# EAGLE design Sequencer_RevD (EAGLE 7.6.0)
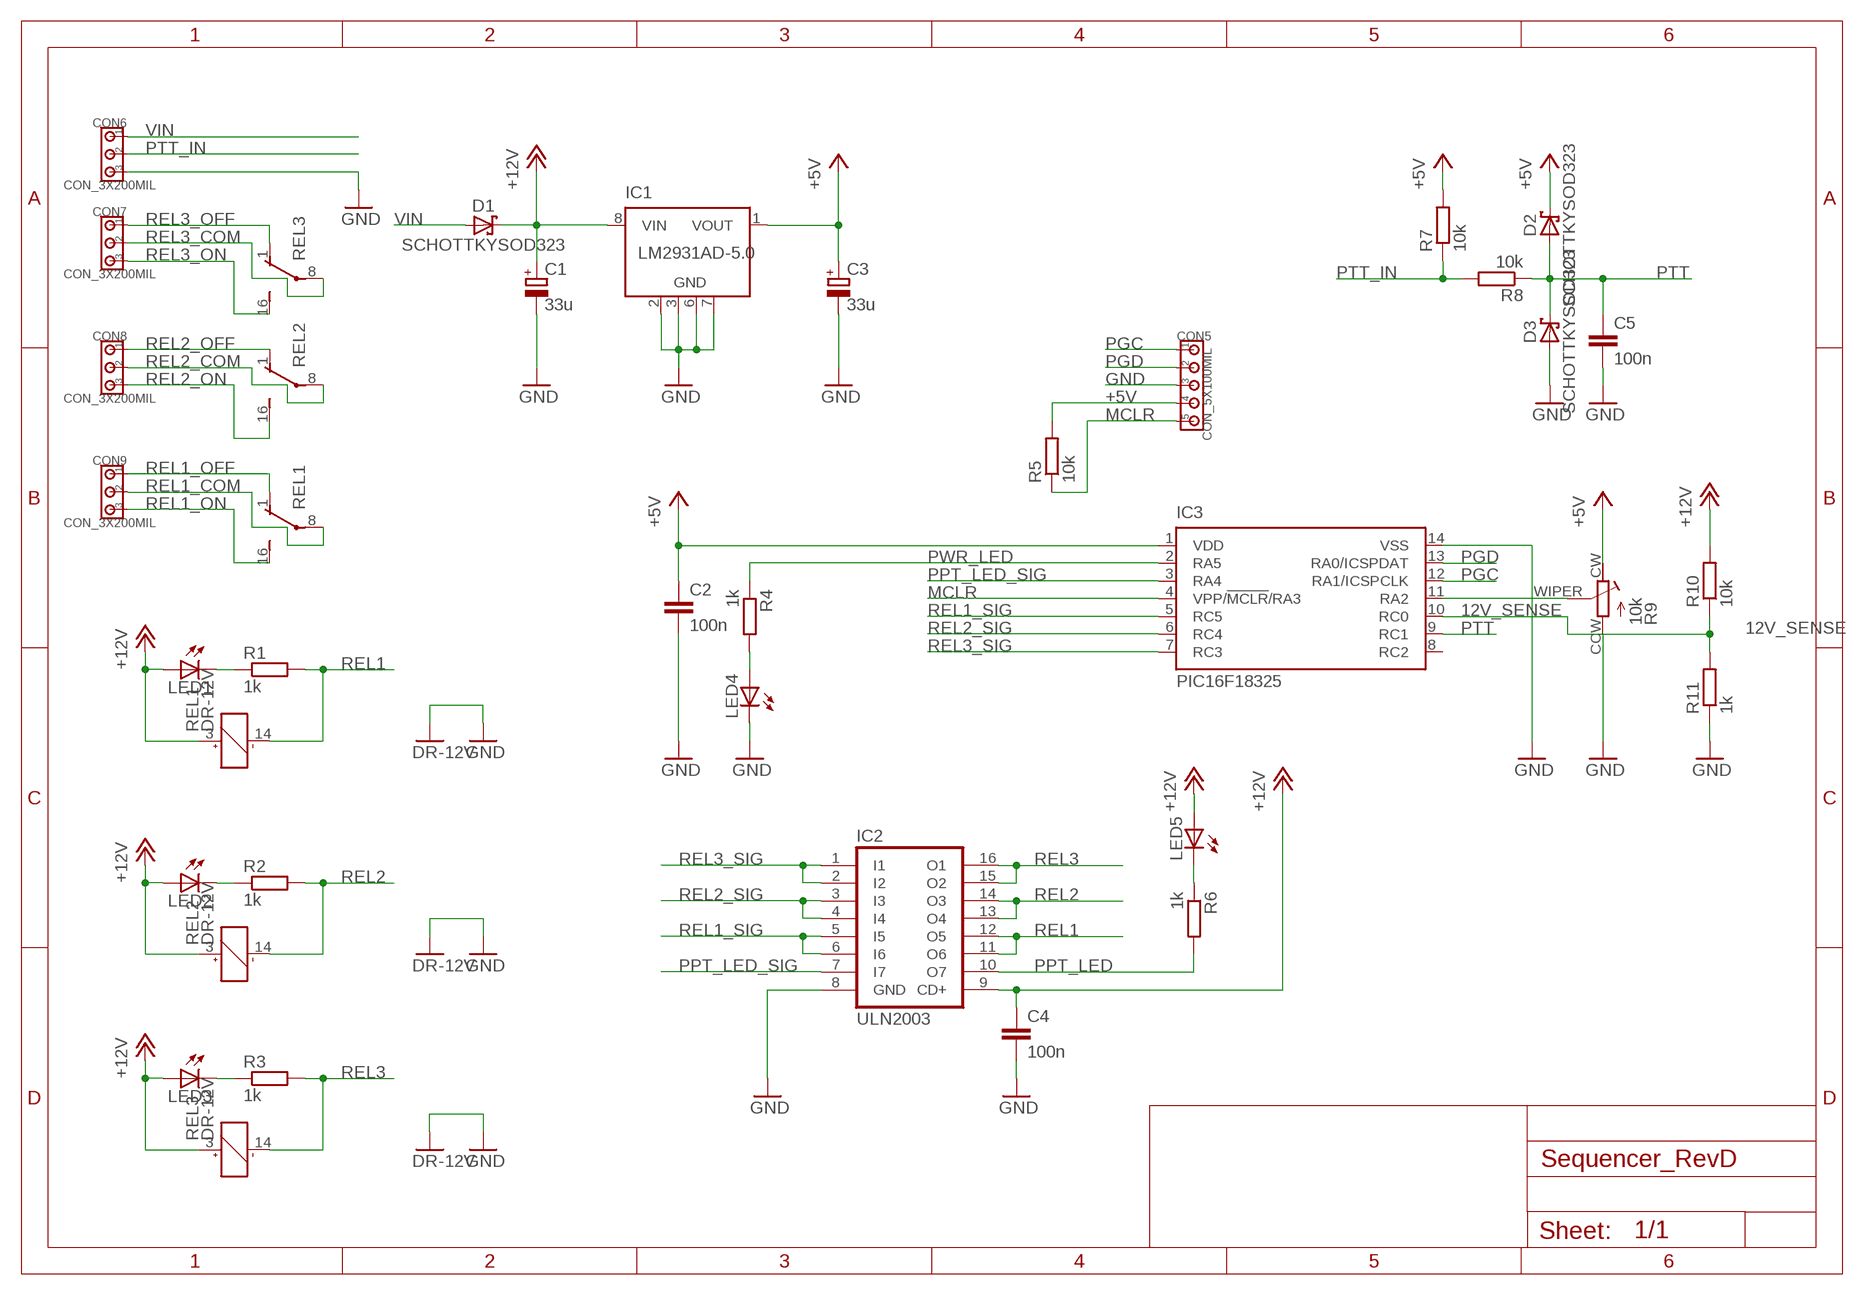
[diagram p0: schematic, sheet 1]

## Parts
C1  33u  C_POLARIZEDSMC_C  [SMC_C]
C2  100n  CC0805  [C0805]
C3  33u  C_POLARIZEDSMC_C  [SMC_C]
C4  100n  CC0805  [C0805]
C5  100n  CC0805  [C0805]
CON5  CON_5X100MIL  [100MIL_5X]
CON6  CON_3X200MIL  [200MIL_3X]
CON7  CON_3X200MIL  [200MIL_3X]
CON8  CON_3X200MIL  [200MIL_3X]
CON9  CON_3X200MIL  [200MIL_3X]
D1  SCHOTTKYSOD323  [SOD323]
D2  SCHOTTKYSOD323  [SOD323]
D3  SCHOTTKYSOD323  [SOD323]
IC1  LM2931AD-5.0  [SOIC8]
IC2  ULN2003  [SO16]
IC3  PIC16F18325  [SO14]
LED1  LED0805  [LED0805]
LED2  LED0805  [LED0805]
LED3  LED0805  [LED0805]
LED4  LED0805  [LED0805]
LED5  LED0805  [LED0805]
R1  1k  RESISTORR0805  [R0805]
R2  1k  RESISTORR0805  [R0805]
R3  1k  RESISTORR0805  [R0805]
R4  1k  RESISTORR0805  [R0805]
R5  10k  RESISTORR0805  [R0805]
R6  1k  RESISTORR0805  [R0805]
R7  10k  RESISTORR0805  [R0805]
R8  10k  RESISTORR0805  [R0805]
R9  10k  TRIMMER3314G  [RTRIM3314G]
R10  10k  RESISTORR0805  [R0805]
R11  1k  RESISTORR0805  [R0805]
REL1  DR-12V  [DR-12V]
REL2  DR-12V  [DR-12V]
REL3  DR-12V  [DR-12V]

## Nets
12V_SENSE: IC3.10(RC0) R10.1 R11.2
+5V: C2.1 C3.+ CON5.4 D2.C IC1.1(VOUT) IC3.1(VDD) R5.2 R7.2 R9.CW
+12V: C1.+ C4.1 D1.C IC1.8(VIN) IC2.9(CD+) LED1.A LED2.A LED3.A LED5.A R10.2 REL1.3(+) REL2.3(+) REL3.3(+)
GND: C1.- C2.2 C3.- C4.2 C5.2 CON5.3 CON6.3 D3.A IC1.2(GND) IC1.3(GND) IC1.6(GND) IC1.7(GND) IC2.8(GND) IC3.14(VSS) LED4.C R9.CCW R11.1 REL1.9(GND) REL2.9(GND) REL3.9(GND)
MCLR: CON5.5 IC3.4(VPP/!MCLR!/RA3) R5.1
N$9: IC3.11(RA2) R9.WIPER
N$10: LED5.C R6.1
N$11: LED4.A R4.2
N$13: LED2.C R2.1
N$14: LED1.C R1.1
N$15: LED3.C R3.1
PGC: CON5.1 IC3.12(RA1/ICSPCLK)
PGD: CON5.2 IC3.13(RA0/ICSPDAT)
PPT_LED: IC2.10(O7) R6.2
PPT_LED_SIG: IC2.7(I7) IC3.3(RA4)
PTT: C5.1 D2.A D3.C IC3.9(RC1) R8.1
PTT_IN: CON6.2 R7.1 R8.2
PWR_LED: IC3.2(RA5) R4.1
REL1: IC2.11(O6) IC2.12(O5) R1.2 REL1.14(-)
REL1_COM [High Voltage]: CON9.2 REL1.8(P)
REL1_OFF [High Voltage]: CON9.1 REL1.1(O)
REL1_ON [High Voltage]: CON9.3 REL1.16(S)
REL1_SIG: IC2.5(I5) IC2.6(I6) IC3.5(RC5)
REL2: IC2.13(O4) IC2.14(O3) R2.2 REL2.14(-)
REL2_COM [High Voltage]: CON8.2 REL2.8(P)
REL2_OFF [High Voltage]: CON8.1 REL2.1(O)
REL2_ON [High Voltage]: CON8.3 REL2.16(S)
REL2_SIG: IC2.3(I3) IC2.4(I4) IC3.6(RC4)
REL3: IC2.15(O2) IC2.16(O1) R3.2 REL3.14(-)
REL3_COM [High Voltage]: CON7.2 REL3.8(P)
REL3_OFF [High Voltage]: CON7.1 REL3.1(O)
REL3_ON [High Voltage]: CON7.3 REL3.16(S)
REL3_SIG: IC2.1(I1) IC2.2(I2) IC3.7(RC3)
VIN: CON6.1 D1.A
Unconnected: IC3.8(RC2)

## Library data of the parts
C1 C3 = 00Capacitor:C_POLARIZED
C2 C4 C5 = 00Capacitor:C: Capacitor
CON5 = 00Connector:CON_5X: 5-pin header
CON6-CON9 = 00Connector:CON_3X: 3-pin header
D1-D3 = 00Diode:SCHOTTKY
IC1 = 00VoltageRegulator:LM2931*
IC2 = 00Transistor:ULN2003: Seven Darlington array
IC3 = 00PIC:PIC16F18325
LED1-LED5 = 00Display:LED: LED
R1-R8 R10 R11 = 00Resistor:RESISTOR: RESISTOR, European symbol
R9 = 00Resistor:TRIMMER
REL1-REL3 = 00MyParts:DR-12V

## Net classes
1 High Voltage: clearance 1.016 mm

## Board
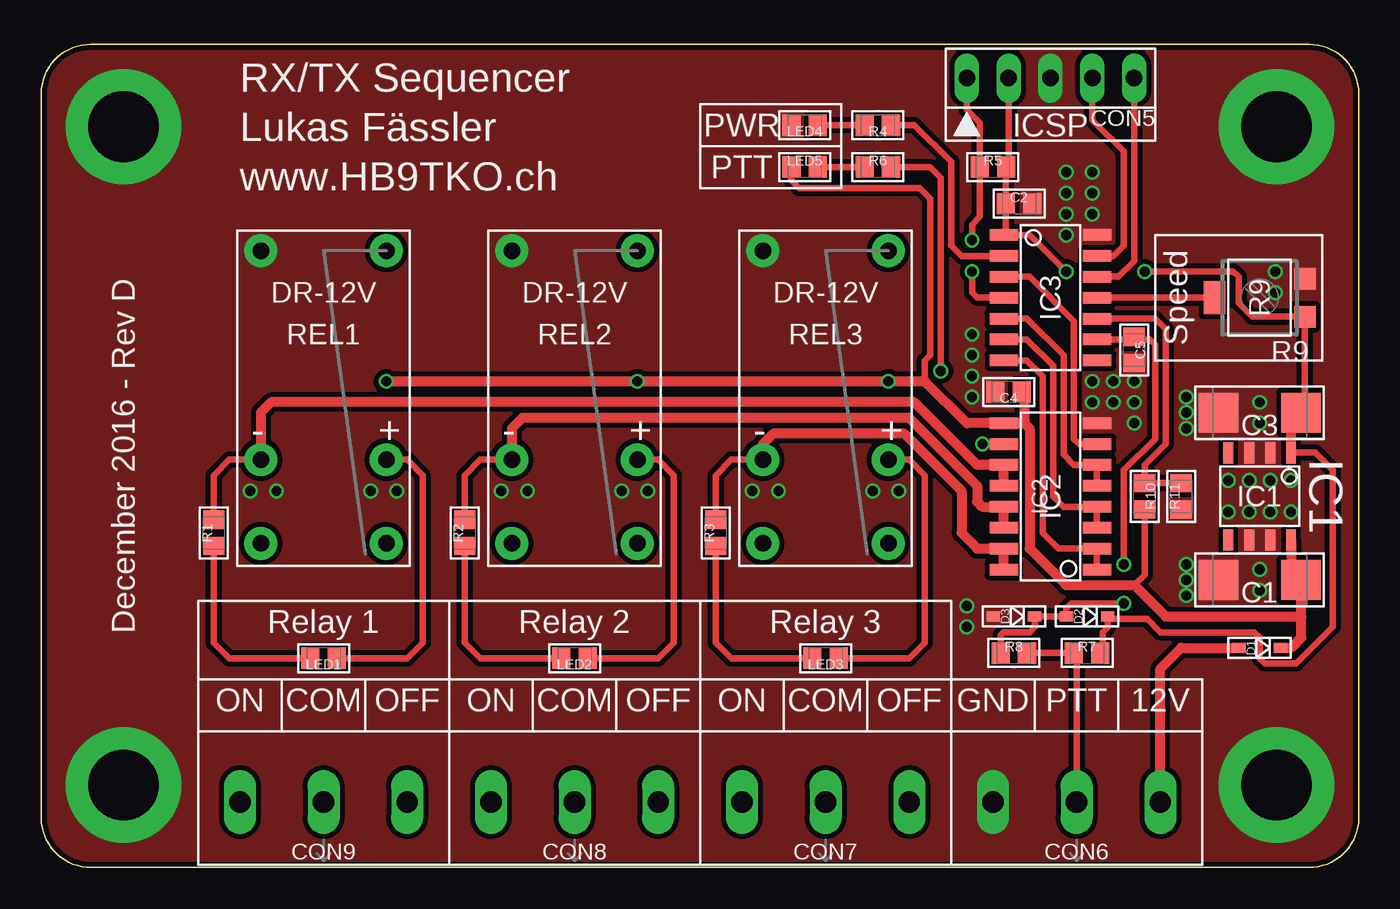
[diagram p1: board, top side]
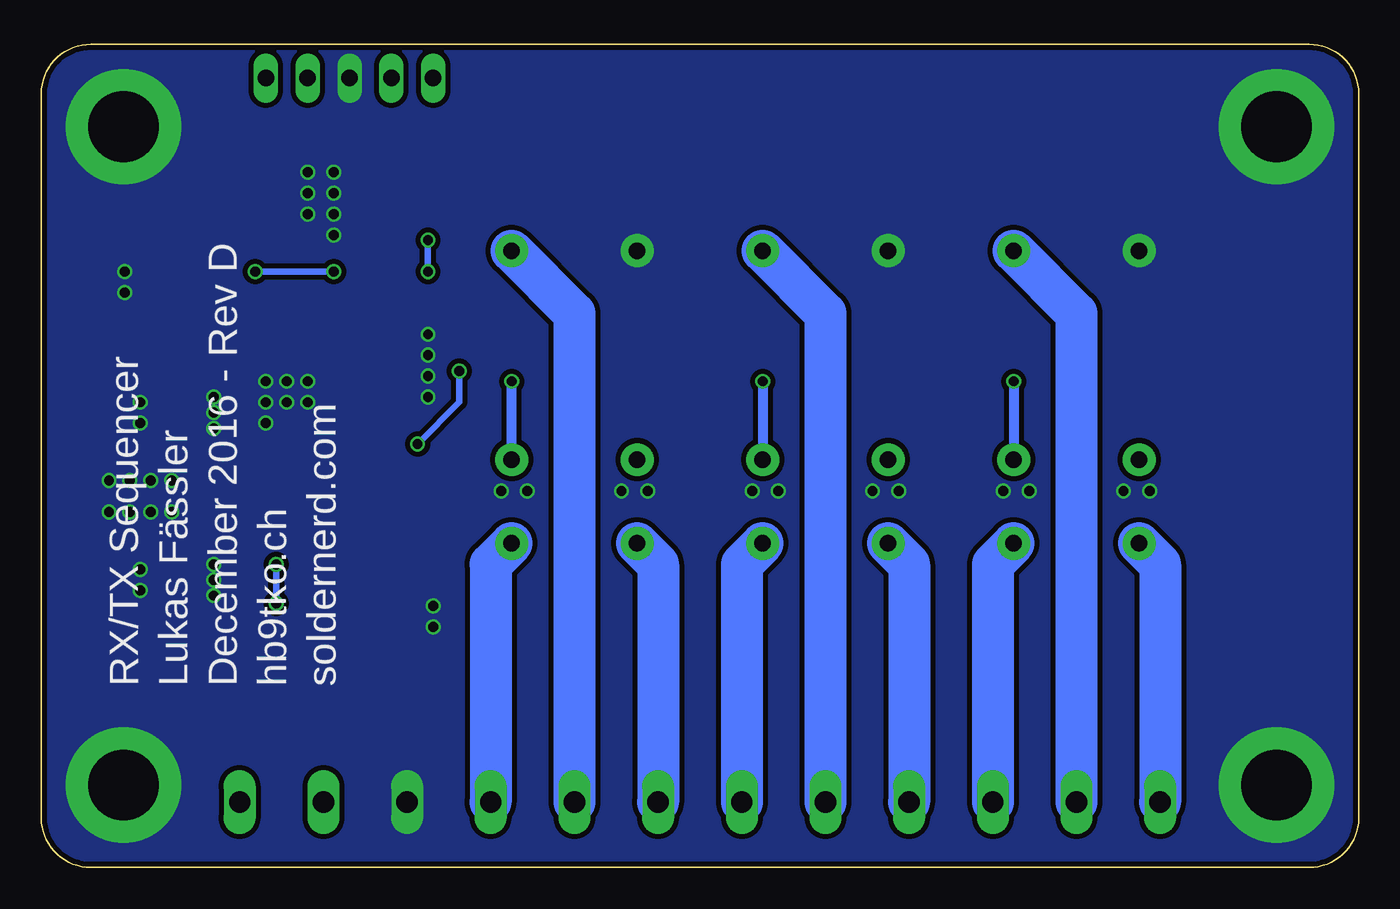
[diagram p2: board, bottom side, seen from below]

Size 80 x 50 mm. Coordinates in mm from the lower left corner, seen from the top.
Outline: 0,3 0,47 arc-90 3,50 77,50 arc-90 80,47 80,3 arc-90 77,0 3,0 arc-90 0,3
Copper layers (1*16): Top 0.035mm / dielectric 1.5mm / Bottom 0.035mm
Design rules "dirt_cheap_dirty_boards.8mil *": minimum track width 5mil, minimum drill 12mil, track to track 8mil, track to pad 8mil, pad to pad 8mil, via to via 8mil, smd to smd 0mil, copper to edge 10mil, drill to drill 10mil, minimum pad ring 8mil, minimum via ring 6mil, stop-mask expansion 2mil, vias tented up to drill 25mil, thermal gap 10mil

### Footprints (pad centres in the part's own frame; a part is rotated, then mirrored left to right if it is on the bottom)
SMC_C = smd 2.4 x 2.4: + -2.5,0; - 2.5,0
C0805 = smd 1.1 x 1.3: 1 -0.8,0; 2 0.8,0
100MIL_5X = drill 1 long: 1 -5.08,0; 2 -2.54,0; 3 0,0; 4 2.54,0; 5 5.08,0
200MIL_3X = drill 1.3 long: 1 -5.08,0; 2 0,0; 3 5.08,0
SOD323 = smd 0.8 x 0.6: A 1.25,0; C -1.25,0
SOIC8 = smd 1.3 x 0.6: 1 -2.65,1.905; 2 -2.65,0.635; 3 -2.65,-0.635; 4 -2.65,-1.905; 5 2.65,-1.905; 6 2.65,-0.635; 7 2.65,0.635; 8 2.65,1.905
SO16 = smd 0.7 x 1.75: 1 -4.445,-2.825; 2 -3.175,-2.825; 3 -1.905,-2.825; 4 -0.635,-2.825; 5 0.635,-2.825; 6 1.905,-2.825; 7 3.175,-2.825; 8 4.445,-2.825; 9 4.445,2.825; 10 3.175,2.825; 11 1.905,2.825; 12 0.635,2.825; 13 -0.635,2.825; 14 -1.905,2.825; 15 -3.175,2.825; 16 -4.445,2.825
SO14 = smd 0.7 x 1.75: 1 -3.81,-2.825; 2 -2.54,-2.825; 3 -1.27,-2.825; 4 0,-2.825; 5 1.27,-2.825; 6 2.54,-2.825; 7 3.81,-2.825; 8 3.81,2.825; 9 2.54,2.825; 10 1.27,2.825; 11 0,2.825; 12 -1.27,2.825; 13 -2.54,2.825; 14 -3.81,2.825
LED0805 = smd 1.1 x 1.3: A -0.8,0; C 0.8,0
R0805 = smd 1.1 x 1.3: 1 -0.8,0; 2 0.8,0
RTRIM3314G = smd 1.3 x 1.3: CCW 1.15,-2.75; CW -1.15,-2.75 | smd 2 x 1.3: WIPER 0,2.75
DR-12V = drill 1 pad 2: 1 -8.89,-3.81; 3 -3.81,-3.81; 8 8.89,-3.81; 9 8.89,3.81; 14 -3.81,3.81; 16 -8.89,3.81

### Placement (x,y rotation side)
C1  73.98,17.46 180 top
C2  59.37,40.32 0 top
C3  73.98,27.62 180 top
C4  58.74,28.89 180 top
C5  66.36,31.43 270 top
CON5  61.28,47.94 180 top
CON6  62.87,3.97 180 top
CON7  47.62,3.97 180 top
CON8  32.38,3.97 180 top
CON9  17.14,3.97 180 top
D1  73.98,13.34 180 top
D2  63.5,15.24 180 top
D3  59.05,15.24 180 top
IC1  73.98,22.54 270 top
IC2  61.28,22.54 90 top
IC3  61.28,34.61 270 top
LED1  17.14,12.7 180 top
LED2  32.38,12.7 180 top
LED3  47.62,12.7 180 top
LED4  46.35,45.09 180 top
LED5  46.35,42.55 0 top
R1  10.48,20.32 90 top
R2  25.72,20.32 90 top
R3  40.96,20.32 90 top
R4  50.8,45.09 180 top
R5  57.78,42.55 0 top
R6  50.8,42.55 0 top
R7  63.5,13.02 0 top
R8  59.05,13.02 0 top
R9  73.98,34.61 90 top
R10  66.99,22.54 270 top
R11  69.22,22.54 90 top
REL1  17.14,28.57 90 top
REL2  32.38,28.57 90 top
REL3  47.62,28.57 90 top

### Tracks (layer width: path | path; a pad name or v marks a point on that pad's centre or on a via)
12V_SENSE
  Top 0.406: R11.2 R10.1 66.99,24.45 68.26,25.72 68.26,32.7 67.63,33.34 IC3.10
+5V  (via drill 0.6)
  Top 0.406: C3.+ 76.73,27.87 R9.CW 73.54,33.46 72.71,34.29 72.71,35.88 72.39,36.2 v66.99,36.2 | IC1.1 77.36,25.19 78.42,24.13 78.42,14.61 76.2,12.38 74.3,12.38 73.98,12.7 73.98,13.97 73.66,14.29 67.94,14.29 67.15,15.08 64.91,15.08 D2.C 64.75,14.59 64.45,14.29 64.45,13.17 R7.2 | CON5.4 58.74,42.7 R5.2 58.57,42.53 C2.1 58.57,38.54 IC3.1 60.01,38.42 v62.23,36.2
  Top 0.61: IC1.1 75.88,27.03 C3.+
  Bottom 0.406: v66.99,36.2 v62.23,36.2
+12V  (via drill 0.6)
  Top 0.406: REL1.3 22.23,24.77 23.18,23.81 23.18,13.65 22.23,12.7 LED1.A | REL2.3 37.47,24.77 38.42,23.81 38.42,13.65 37.47,12.7 LED2.A | REL3.3 52.7,24.77 53.66,23.81 53.66,13.65 52.7,12.7 LED3.A | LED5.A 45.55,41.76 46.04,41.27 53.34,41.27 53.98,40.64 53.98,31.11 53.66,30.8 53.66,29.53 | R10.2 66.99,17.78 66.36,17.14
  Top 0.61: v20.95,29.53 v36.2,29.53 v51.44,29.53 53.66,29.53 56.2,26.99 IC2.9 59.69,26.99 | D1.C 75.88,13.34 76.52,13.97 76.52,15.24 | 76.52,15.24 76.52,17.42 C1.+ 75.88,18.06 IC1.8 | 59.69,26.99 60.01,26.67 60.01,19.37 62.23,17.14 66.36,17.14 68.26,15.24 76.52,15.24 | C4.1 arc-90 59.69,28.74 59.69,26.99
  Bottom 0.61: REL3.3 v51.44,29.53 | v36.2,29.53 REL2.3 | v20.95,29.53 REL1.3
GND  (via drill 0.6, 4.3 pad 7)
  other vias: 5,45 75,5 5,5 75,45 73.98,28.26 63.82,29.53 66.36,28.26 73.98,26.99 63.82,39.69 69.53,28.57 69.53,27.62 75.88,23.5 74.61,23.5 75.88,21.59 74.61,21.59 73.34,21.59 72.07,21.59 72.07,23.5 73.34,23.5 73.98,16.83 73.98,18.1 74.93,36.2 74.93,34.92 69.53,17.46 56.2,15.88 56.2,14.61 69.53,18.41 66.36,26.99 62.23,40.96 63.82,40.96 62.23,42.23 62.23,38.42 62.23,39.69 66.36,29.53 44.77,22.86 52.07,22.86 43.18,22.86 50.48,22.86 12.7,22.86 14.29,22.86 20,22.86 21.59,22.86 27.94,22.86 29.53,22.86 35.24,22.86 36.83,22.86 69.53,26.67 69.53,16.51 65.09,29.53 63.82,42.23 56.52,31.11 56.52,29.84 56.52,32.38 56.52,28.57 63.82,28.26 65.09,28.26
  pour Top (isolate 0.305, no thermals): 0,40 0,47 arc-90 3,50 25,50 77,50 arc-90 80,47 80,35 80,3 arc-90 77,0 50,0 3,0 arc-90 0,3
  pour Bottom (isolate 0.305, no thermals): 0,35 0,47 arc-90 3,50 30,50 77,50 arc-90 80,47 80,30 80,3 arc-90 77,0 60,0 3,0 arc-90 0,3
MCLR  (via drill 0.6)
  Top 0.406: 57.15,42.71 R5.1 | IC3.4 56.83,34.61 56.52,34.92 v56.52,36.2 | v56.52,38.1 56.52,39.05 56.98,39.52 R5.1 | CON5.5 56.2,46.04 56.98,45.25 R5.1
  Bottom 0.406: v56.52,36.2 v56.52,38.1
N$9
  Top 0.406: R9.WIPER IC3.11
N$10
  Top 0.406: R6.1 LED5.C
N$11
  Top 0.406: LED4.A R4.2
N$13
  Top 0.406: R2.1 25.72,13.65 26.67,12.7 LED2.C
N$14
  Top 0.406: R1.1 10.48,13.65 11.43,12.7 LED1.C
N$15
  Top 0.406: R3.1 40.96,13.65 41.91,12.7 LED3.C
PGC
  Top 0.406: IC3.12 65.41,35.88 66.36,36.83 CON5.1
PGD
  Top 0.406: IC3.13 65.09,37.15 65.72,37.78 65.72,43.5 63.82,45.4 CON5.2
PPT_LED  (via drill 0.6)
  Top 0.406: IC2.10 v57.15,25.72 | v54.61,30.16 54.61,41.91 53.98,42.55 R6.2
  Bottom 0.406: v54.61,30.16 54.61,28.26 v57.15,25.72
PPT_LED_SIG
  Top 0.406: IC2.7 63.02,25.72 62.71,26.04 62.71,33.18 60.01,35.88 IC3.3
PTT  (via drill 0.6)
  Top 0.406: R8.1 58.26,14.12 58.42,14.29 60.01,14.29 60.33,14.61 60.33,15.22 D3.C D2.A 62.25,15.74 62.55,16.03 v65.72,16.03 | v65.72,18.41 65.72,24.13 67.63,26.04 67.63,31.75 67.31,32.07 66.36,32.07 | IC3.9 66.36,32.07 | 66.36,32.07 C5.1
  Bottom 0.406: v65.72,18.41 v65.72,16.03
PTT_IN
  Top 0.406: R8.2 R7.1 62.87,12.85 CON6.2
PWR_LED
  Top 0.406: IC3.2 55.88,37.15 55.24,37.78 55.24,42.86 53.02,45.09 R4.1
REL1
  Top 0.406: REL1.14 11.43,24.77 10.48,23.81 R1.2
  Top 0.61: IC2.12 IC2.11 56.83,24.45 53.02,28.26 13.97,28.26 13.34,27.62 REL1.14
REL1_COM
  Bottom 2.54: REL1.8 17.14,33.66 CON9.2
REL1_OFF
  Bottom 2.54: REL1.1 22.23,18.41 CON9.1
REL1_ON
  Bottom 2.54: REL1.16 12.06,18.41 CON9.3
REL1_SIG
  Top 0.406: IC2.5 IC2.6 62.71,24.45 62.07,25.08 62.07,31.11 59.85,33.34 IC3.5
REL2
  Top 0.406: REL2.14 26.67,24.77 25.72,23.81 R2.2
  Top 0.61: IC2.14 IC2.13 57.15,21.91 56.83,22.23 56.83,23.18 52.7,27.3 29.21,27.3 28.57,26.67 REL2.14
REL2_COM
  Bottom 2.54: REL2.8 32.38,33.66 CON8.2
REL2_OFF
  Bottom 2.54: REL2.1 37.47,18.41 CON8.1
REL2_ON
  Bottom 2.54: REL2.16 27.3,18.41 CON8.3
REL2_SIG
  Top 0.406: IC2.3 IC2.4 62.07,21.91 61.44,22.54 61.44,30.48 59.85,32.07 IC3.6
REL3
  Top 0.406: REL3.14 41.91,24.77 40.96,23.81 R3.2
  Top 0.61: IC2.16 IC2.15 56.83,19.37 55.88,20.32 55.88,22.86 52.39,26.35 44.45,26.35 43.81,25.72 REL3.14
REL3_COM
  Bottom 2.54: REL3.8 47.62,33.66 CON7.2
REL3_OFF
  Bottom 2.54: REL3.1 52.7,18.41 CON7.1
REL3_ON
  Bottom 2.54: REL3.16 42.55,18.41 CON7.3
REL3_SIG
  Top 0.406: IC2.1 IC2.2 61.75,19.37 60.8,20.32 60.8,29.84 59.85,30.8 IC3.7
VIN
  Top 0.61: CON6.1 67.94,12.06 69.22,13.34 D1.A

### Text on the board
tPlace: RX/TX Sequencer | Lukas Fässler | PWR | ICSP | PTT | www.HB9TKO.ch | Speed | December 2016 - Rev D | Relay 1 | Relay 2 | Relay 3 | ON | COM | OFF | ON | COM | OFF | ON | COM | OFF | GND | PTT | 12V
bPlace: soldernerd.com | hb9tko.ch | December 2016 - Rev D | Lukas Fässler | RX/TX Sequencer